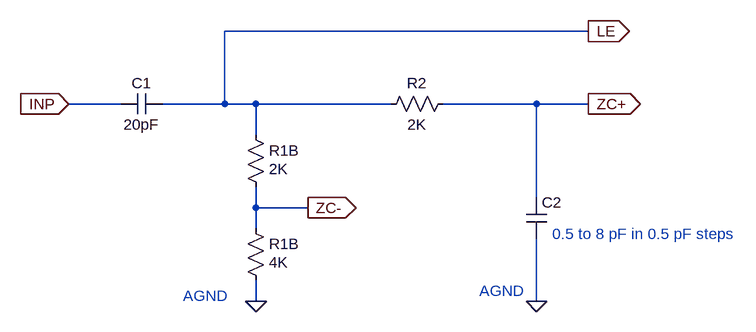
[diagram p0: schematic nowlin_fast.asc]
nowlin_fast.asc, the LTspice schematic file:
Version 4
SHEET 1 1532 708
WIRE 1296 -80 736 -80
WIRE 576 32 496 32
WIRE 736 32 736 -80
WIRE 736 32 640 32
WIRE 784 32 736 32
WIRE 992 32 784 32
WIRE 1216 32 1072 32
WIRE 1296 32 1216 32
WIRE 784 80 784 32
WIRE 1216 176 1216 32
WIRE 784 192 784 160
WIRE 864 192 784 192
WIRE 784 224 784 192
WIRE 784 336 784 304
WIRE 1216 336 1216 240
FLAG 784 336 0
FLAG 496 32 INP
IOPIN 496 32 In
FLAG 864 192 ZC-
IOPIN 864 192 Out
FLAG 1216 336 0
FLAG 1296 32 ZC+
IOPIN 1296 32 Out
FLAG 1296 -80 LE
IOPIN 1296 -80 Out
SYMBOL cap 640 16 R90
WINDOW 0 0 32 VBottom 2
WINDOW 3 32 32 VTop 2
SYMATTR InstName C1
SYMATTR Value 20pF
SYMBOL res 768 208 R0
WINDOW 3 36 68 Left 2
SYMATTR Value 4K
SYMATTR InstName R1B
SYMBOL res 768 64 R0
WINDOW 3 36 68 Left 2
SYMATTR Value 2K
SYMATTR InstName R1B
SYMBOL res 1088 16 R90
WINDOW 0 0 56 VBottom 2
WINDOW 3 32 56 VTop 2
SYMATTR InstName R2
SYMATTR Value 2K
SYMBOL cap 1200 176 R0
SYMATTR InstName C2
SYMATTR Value ""
TEXT 672 328 Left 2 ;AGND
TEXT 1128 320 Left 2 ;AGND
TEXT 1240 232 Left 2 ;0.5 to 8 pF in 0.5 pF steps

The netlist it stands for:
* nowlin_fast.asc
C1 LE INP 20pF
R1B ZC- 0 4K
R1B LE ZC- 2K
R2 ZC+ LE 2K
C2 ZC+ 0
* AGND
* AGND
* 0.5 to 8 pF in 0.5 pF steps
.backanno
.end